# Altium schematic sheet 15-HDMI TRNSMITTER.SchDoc
size 513 x 386 mm
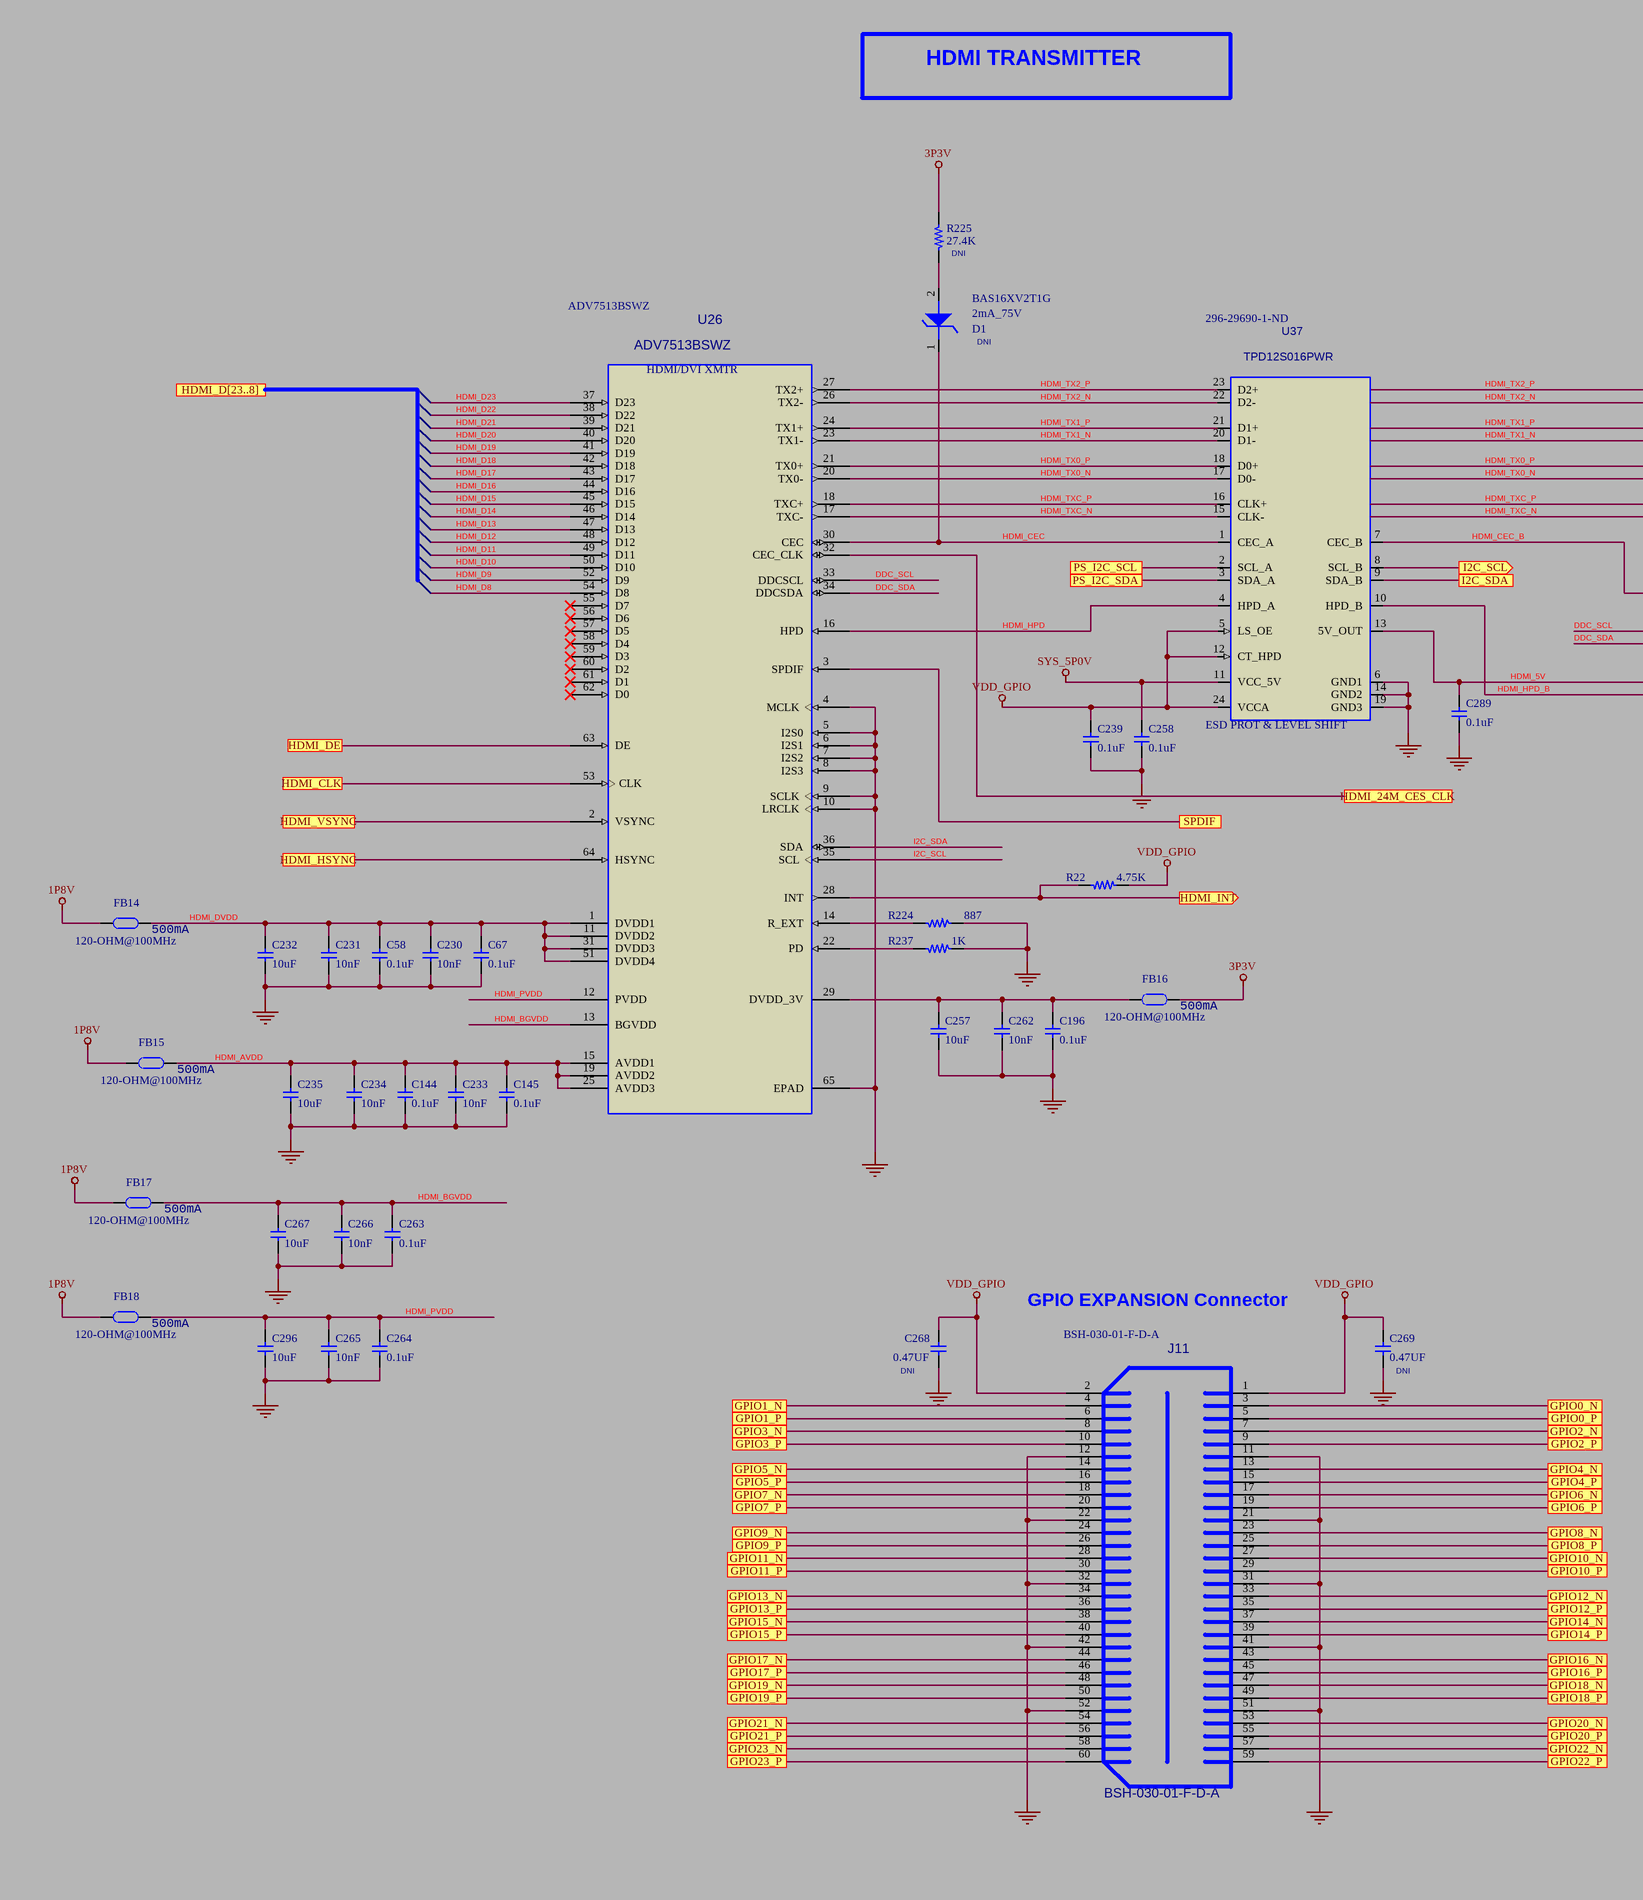
[diagram p0: 15-HDMI TRNSMITTER.SchDoc, left]
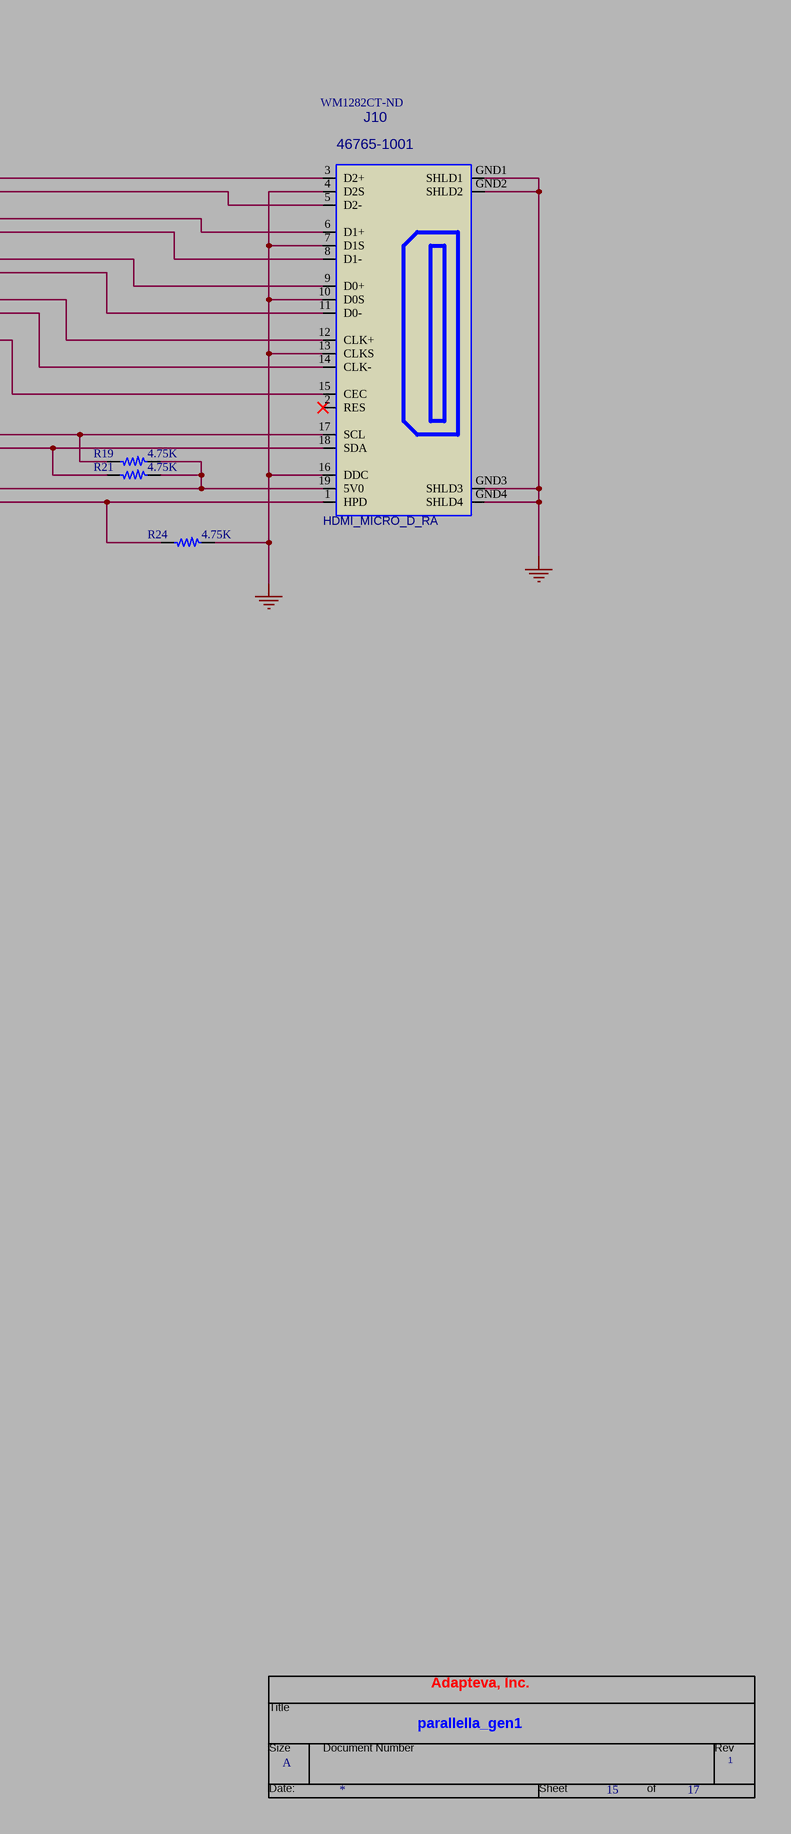
[diagram p1: 15-HDMI TRNSMITTER.SchDoc, right]

## Parts
*  RevCode: 1  Title: parallella_gen1  Page Size: A  Page Number: 15  Page Count: 17  OrgAddr1: Adapteva, Inc.  (hidden comment: TitleBlock0)  (graphical)
C58  0.1uF  [C0402]
C67  0.1uF  [C0402]
C144  0.1uF  [C0402]
C145  0.1uF  [C0402]
C196  0.1uF  [C0402]
C230  10nF  [C0402]
C231  10nF  [C0402]
C232  10uF  [C0603]
C233  10nF  [C0402]
C234  10nF  [C0402]
C235  10uF  [C0603]
C239  0.1uF  [C0402]
C257  10uF  [C0603]
C258  0.1uF  [C0402]
C262  10nF  [C0402]
C263  0.1uF  [C0402]
C264  0.1uF  [C0402]
C265  10nF  [C0402]
C266  10nF  [C0402]
C267  10uF  [C0603]
C268  0.47UF  INSTALL: DNI  [C0402]
C269  0.47UF  INSTALL: DNI  [C0402]
C289  0.1uF  [C0402]
C296  10uF  [C0603]
D1  2mA_75V  Vendor PN: BAS16XV2T1G  INSTALL: DNI  [SOD-523]
FB14  120-OHM@100MHz  [FBEAD_0402]
FB15  120-OHM@100MHz  [FBEAD_0402]
FB16  120-OHM@100MHz  [FBEAD_0402]
FB17  120-OHM@100MHz  [FBEAD_0402]
FB18  120-OHM@100MHz  [FBEAD_0402]
J10  HDMI_MICRO_D_RA  MFG PART NO: 46765-1001  Supplier Part Number 1: WM1282CT-ND  [HDMI_MICRO19_6P5X7P5X2P9H_P4P]
J11  BSH-030-01-F-D-A  [CONN_BSH60P_13P59X25P88_P5P_V]
R19  4.75K  [R0402]
R21  4.75K  [R0402]
R22  4.75K  [R0402]
R24  4.75K  [R0402]
R224  887  [R0402]
R225  27.4K  INSTALL: DNI  [R0402]
R237  1K  [R0402]
U26  HDMI/DVI XMTR  Vendor PN: ADV7513BSWZ  [LQFP64_10SQX1P6MMH_P5MMP]
U37  ESD PROT & LEVEL SHIFT  MFG PART NO: TPD12S016PWR  Supplier Part Number 1: 296-29690-1-ND  [TSSOP24_6P4X7P9X1P2MMH_P65P]

## Ports
GPIO0_N, GPIO0_P, GPIO1_N, GPIO1_P, GPIO2_N, GPIO2_P, GPIO3_N, GPIO3_P, GPIO4_N, GPIO4_P, GPIO5_N, GPIO5_P, GPIO6_N, GPIO6_P, GPIO7_N, GPIO7_P, GPIO8_N, GPIO8_P, GPIO9_N, GPIO9_P, GPIO10_N, GPIO10_P, GPIO11_N, GPIO11_P, GPIO12_N, GPIO12_P, GPIO13_N, GPIO13_P, GPIO14_N, GPIO14_P, GPIO15_N, GPIO15_P, GPIO16_N, GPIO16_P, GPIO17_N, GPIO17_P, GPIO18_N, GPIO18_P, GPIO19_N, GPIO19_P, GPIO20_N, GPIO20_P, GPIO21_N, GPIO21_P, GPIO22_N, GPIO22_P, GPIO23_N, GPIO23_P, HDMI_24M_CES_CLK, HDMI_CLK, HDMI_D[23..8], HDMI_DE, HDMI_HSYNC, HDMI_INT (out), HDMI_VSYNC, I2C_SCL (out), I2C_SDA, PS_I2C_SCL, PS_I2C_SDA, SPDIF

## Nets
1P8V: FB14.1 FB15.1 FB17.1 FB18.1
3P3V: FB16.2 R225.1
GND: C58.2 C67.2 C144.2 C145.2 C196.2 C230.2 C231.2 C232.2 C233.2 C234.2 C235.2 C239.2 C257.2 C258.2 C262.2 C263.2 C264.2 C265.2 C266.2 C267.2 C268.2 C269.2 C289.2 C296.2 J10.4(D2S) J10.7(D1S) J10.10(D0S) J10.13(CLKS) J10.16(DDC) J10.GND1(SHLD1) J10.GND2(SHLD2) J10.GND3(SHLD3) J10.GND4(SHLD4) J11.11 J11.12 J11.21 J11.22 J11.31 J11.32 J11.41 J11.42 J11.51 J11.52 R24.2 R224.2 R237.2 U26.4(MCLK) U26.5(I2S0) U26.6(I2S1) U26.7(I2S2) U26.8(I2S3) U26.9(SCLK) U26.10(LRCLK) U26.65(EPAD) U37.6(GND1) U37.14(GND2) U37.19(GND3)
SYS_5P0V: C258.1 U37.11(VCC_5V)
VDD_GPIO: C239.1 C268.1 C269.1 J11.1 J11.2 R22.2 U37.5(LS_OE) U37.12(CT_HPD) U37.24(VCCA)
DDC_SCL: J10.17(SCL) R19.1 U26.33(DDCSCL)
DDC_SDA: J10.18(SDA) R21.1 U26.34(DDCSDA)
GPIO0_N: J11.3 ; port GPIO0_N
GPIO0_P: J11.5 ; port GPIO0_P
GPIO1_N: J11.4 ; port GPIO1_N
GPIO1_P: J11.6 ; port GPIO1_P
GPIO2_N: J11.7 ; port GPIO2_N
GPIO2_P: J11.9 ; port GPIO2_P
GPIO3_N: J11.8 ; port GPIO3_N
GPIO3_P: J11.10 ; port GPIO3_P
GPIO4_N: J11.13 ; port GPIO4_N
GPIO4_P: J11.15 ; port GPIO4_P
GPIO5_N: J11.14 ; port GPIO5_N
GPIO5_P: J11.16 ; port GPIO5_P
GPIO6_N: J11.17 ; port GPIO6_N
GPIO6_P: J11.19 ; port GPIO6_P
GPIO7_N: J11.18 ; port GPIO7_N
GPIO7_P: J11.20 ; port GPIO7_P
GPIO8_N: J11.23 ; port GPIO8_N
GPIO8_P: J11.25 ; port GPIO8_P
GPIO9_N: J11.24 ; port GPIO9_N
GPIO9_P: J11.26 ; port GPIO9_P
GPIO10_N: J11.27 ; port GPIO10_N
GPIO10_P: J11.29 ; port GPIO10_P
GPIO11_N: J11.28 ; port GPIO11_N
GPIO11_P: J11.30 ; port GPIO11_P
GPIO12_N: J11.33 ; port GPIO12_N
GPIO12_P: J11.35 ; port GPIO12_P
GPIO13_N: J11.34 ; port GPIO13_N
GPIO13_P: J11.36 ; port GPIO13_P
GPIO14_N: J11.37 ; port GPIO14_N
GPIO14_P: J11.39 ; port GPIO14_P
GPIO15_N: J11.38 ; port GPIO15_N
GPIO15_P: J11.40 ; port GPIO15_P
GPIO16_N: J11.43 ; port GPIO16_N
GPIO16_P: J11.45 ; port GPIO16_P
GPIO17_N: J11.44 ; port GPIO17_N
GPIO17_P: J11.46 ; port GPIO17_P
GPIO18_N: J11.47 ; port GPIO18_N
GPIO18_P: J11.49 ; port GPIO18_P
GPIO19_N: J11.48 ; port GPIO19_N
GPIO19_P: J11.50 ; port GPIO19_P
GPIO20_N: J11.53 ; port GPIO20_N
GPIO20_P: J11.55 ; port GPIO20_P
GPIO21_N: J11.54 ; port GPIO21_N
GPIO21_P: J11.56 ; port GPIO21_P
GPIO22_N: J11.57 ; port GPIO22_N
GPIO22_P: J11.59 ; port GPIO22_P
GPIO23_N: J11.58 ; port GPIO23_N
GPIO23_P: J11.60 ; port GPIO23_P
HDMI_5V: C289.1 J10.19(5V0) R19.2 R21.2 U37.13(5V_OUT)
HDMI_24M_CES_CLK: U26.32(CEC_CLK) ; port HDMI_24M_CES_CLK
HDMI_AVDD: C144.1 C145.1 C233.1 C234.1 C235.1 FB15.2 U26.15(AVDD1) U26.19(AVDD2) U26.25(AVDD3)
HDMI_BGVDD: C263.1 C266.1 C267.1 FB17.2 U26.13(BGVDD)
HDMI_CEC: D1.1(CATHODE) U26.30(CEC) U37.1(CEC_A)
HDMI_CEC_B: J10.15(CEC) U37.7(CEC_B)
HDMI_CLK: U26.53(CLK) ; port HDMI_CLK
HDMI_D8: U26.54(D8)
HDMI_D9: U26.52(D9)
HDMI_D10: U26.50(D10)
HDMI_D11: U26.49(D11)
HDMI_D12: U26.48(D12)
HDMI_D13: U26.47(D13)
HDMI_D14: U26.46(D14)
HDMI_D15: U26.45(D15)
HDMI_D16: U26.44(D16)
HDMI_D17: U26.43(D17)
HDMI_D18: U26.42(D18)
HDMI_D19: U26.41(D19)
HDMI_D20: U26.40(D20)
HDMI_D21: U26.39(D21)
HDMI_D22: U26.38(D22)
HDMI_D23: U26.37(D23)
HDMI_DE: U26.63(DE) ; port HDMI_DE
HDMI_DVDD: C58.1 C67.1 C230.1 C231.1 C232.1 FB14.2 U26.1(DVDD1) U26.11(DVDD2) U26.31(DVDD3) U26.51(DVDD4)
HDMI_HPD: U26.16(HPD) U37.4(HPD_A)
HDMI_HPD_B: J10.1(HPD) R24.1 U37.10(HPD_B)
HDMI_HSYNC: U26.64(HSYNC) ; port HDMI_HSYNC
HDMI_INT: R22.1 U26.28(INT) ; port HDMI_INT
HDMI_PVDD: C264.1 C265.1 C296.1 FB18.2 U26.12(PVDD)
HDMI_TX0_N: J10.11(D0-) U26.20(TX0-) U37.17(D0-)
HDMI_TX0_P: J10.9(D0+) U26.21(TX0+) U37.18(D0+)
HDMI_TX1_N: J10.8(D1-) U26.23(TX1-) U37.20(D1-)
HDMI_TX1_P: J10.6(D1+) U26.24(TX1+) U37.21(D1+)
HDMI_TX2_N: J10.5(D2-) U26.26(TX2-) U37.22(D2-)
HDMI_TX2_P: J10.3(D2+) U26.27(TX2+) U37.23(D2+)
HDMI_TXC_N: J10.14(CLK-) U26.17(TXC-) U37.15(CLK-)
HDMI_TXC_P: J10.12(CLK+) U26.18(TXC+) U37.16(CLK+)
HDMI_VSYNC: U26.2(VSYNC) ; port HDMI_VSYNC
I2C_SCL: U37.8(SCL_B) ; port I2C_SCL
I2C_SCL: U26.35(SCL)  [a separate net that carries the same name]
I2C_SDA: U37.9(SDA_B) ; port I2C_SDA
I2C_SDA: U26.36(SDA)  [a separate net that carries the same name]
PS_I2C_SCL: U37.2(SCL_A) ; port PS_I2C_SCL
PS_I2C_SDA: U37.3(SDA_A) ; port PS_I2C_SDA
SPDIF: U26.3(SPDIF) ; port SPDIF
NetC196_1: C196.1 C257.1 C262.1 FB16.1 U26.29(DVDD_3V)
NetD1_2: D1.2(ANODE) R225.2
NetR224_1: R224.1 U26.14(R_EXT)
NetR237_1: R237.1 U26.22(PD)

Not connected (* = marked no-connect by the designer): J10 2(RES)*; U26 55(D7)* 56(D6)* 57(D5)* 58(D4)* 59(D3)* 60(D2)* 61(D1)* 62(D0)*

## Notes on the sheet
- HDMI TRANSMITTER
- GPIO EXPANSION Connector
- (in symbol BLM15AG121SN1D) 500mA
- (in symbol TitleBlock0) Title; Size; Document Number; Rev; Date:; Sheet; of

## Library data of the parts
C58 C67 C144 C145 C196 C239 C258 C263 C264 C289 = CAP0402_0P1UF_X5R_35V: CAP, 0402, 0.1UF, X5R, 35V; ALT_SYMBOLS: C0402_BGA; Vendor PN: GMK105BJ104KV-F; Vendor: TAIYO YUDEN; DEVICE: CAP0402_0P1UF_X5R_35V; MFG PART NO: GMK105BJ104KV-F; MFG: TAIYO YUDEN; PCB Footprint: C0402
C230 C231 C233 C234 C262 C265 C266 = CAP0402_10NF_X7R_16V: CAP, 0402, 10NF, X7R, 16V; MFG PART NO: C1005X7R1C103K; MFG: TDK; ALT_SYMBOLS: C0402_BGA; Vendor: TDK; Vendor PN: C1005X7R1C103K; PCB Footprint: C0402
C232 C235 C257 C267 C296 = CAP0603_10UF_X5R: CAP, 0603, 10UF, X5R, 10V; MFG PART NO: LMK107BJ106MALTD; MFG: TAIYO YUDEN; DEVICE: CAP0603_10UF_X5R; Vendor: TAIYO YUDEN; Vendor PN: LMK107BJ106MALTD; PCB Footprint: C0603
C268 C269 = CAP0402_0P47UF_X5R: CAP, 0402, 0.47UF, X5R, 16V; MFG PART NO: C1005X5R1C474K; MFG: TDK; ALT_SYMBOLS: C0402_BGA; DEVICE: CAP0402_0P47UF_X5R; Vendor: TDK; Vendor PN: C1005X5R1C474K; PCB Footprint: C0402
D1 = DIODE_BAS16XV2T1G: DIODE, SWITCH, 200mA, 75V, SOD523; MFG: ON SEMICONDUCTOR; MFG PART NO: BAS16XV2T1G; DEVICE: DIODE_BAS16XV2T1G; Vendor: ON SEMICONDUCTOR; PCB Footprint: SOD-523
FB14-FB18 = BLM15AG121SN1D: FERRITE, BEAD, 0402, 120 OHM@ 100MHZ, 500mA, SMT; Vendor: MURATA; Vendor PN: BLM15AG121SN1D; DEVICE: BLM15AG121SN1D; MFG: MURATA; MFG PART NO: BLM15AG121SN1D; PCB Footprint: FBEAD_0402
J10 = HDMI_MICRO_D_RA_SMT: CONN, HDMI, RCPT, MICRO D, RA, SMT; Vendor: MOLEX; Vendor PN: 46765-1001; DEVICE: HDMI_MICRO_D_RA_SMT; MFG: MOLEX; PCB Footprint: HDMI_MICRO19_6P5X7P5X2P9H_P4P; Supplier 1: Digi-Key
J11 = CON_BSH_030_VERT: Vendor: SAMTEC; Vendor PN: BSH-030-01-F-D-A; DEVICE: CON_BSH_030_VERT; PCB Footprint: CONN_BSH60P_13P59X25P88_P5P_V; Supplier 1: Arrow; Supplier Part Number 1: BSH-030-01-F-D-A
R19 R21 R22 R24 = RES0402_4K75: RES, 0402, 4.75K, 1%; MFG PART NO: CRCW04024K75FKED; MFG: VISHAY; Vendor: VISHAY/DALE; ALT_SYMBOLS: R0402_BGA; DEVICE: RES0402_4K75; Vendor PN: CRCW04024K75FKED; PCB Footprint: R0402
R224 = RES0402_887: RES, 0402, 887; Vendor PN: CRCW0402887RFKED; Vendor: VISHAY/DALE; MFG: VISHAY; ALY_SYMBOLS: R0402_BGA; MFG PART NO: CRCW0402887RFKED; DEVICE: RES0402_887; PCB Footprint: R0402
R225 = RES0402_27K4: RES, 0402, 27.4K; Vendor PN: CRCW040227K4FKED; Vendor: VISHAY/DALE; MFG: VISHAY; ALT_SYMBOLS: R0402_BGA; MFG PART NO: CRCW040227K4FKED; DEVICE: RES0402_27K4; PCB Footprint: R0402
R237 = RES0402_1K: RES, 0402, 1K; MFG PART NO: CRCW04021K00FKED; ALT_SYMBOLS: R0402_BGA; MFG: VISHAY; Vendor: VISHAY/DALE; DEVICE: RES0402_1K; Vendor PN: CRCW04021K00FKED; PCB Footprint: R0402
U26 = HDMI_DVI_XCVR_ADV7513: IC, HDMI/DVI TRANSMITTER, PQFP64; Vendor: ANALOG DEVICES; DEVICE: HDMI_DVI_XCVR_ADV7513; Supplier 1: Arrow; Supplier Part Number 1: ADV7513BSWZ
U37 = TPD12S016: IC, HDMI ESD PROT AND LEVEL SHIFT, TSSOP24; Vendor: TEXAS INSTRUMENTS; Vendor PN: TPD12S016PWR; DEVICE: TPD12S016; MFG: TEXAS INSTRUMENTS; PCB Footprint: TSSOP24_6P4X7P9X1P2MMH_P65P; Supplier 1: Digi-Key
* = TitleBlock0: Page Create Date: March  8, 1995; Page Modify Date: *